# EAGLE design Thermostat (EAGLE 9.1.1)
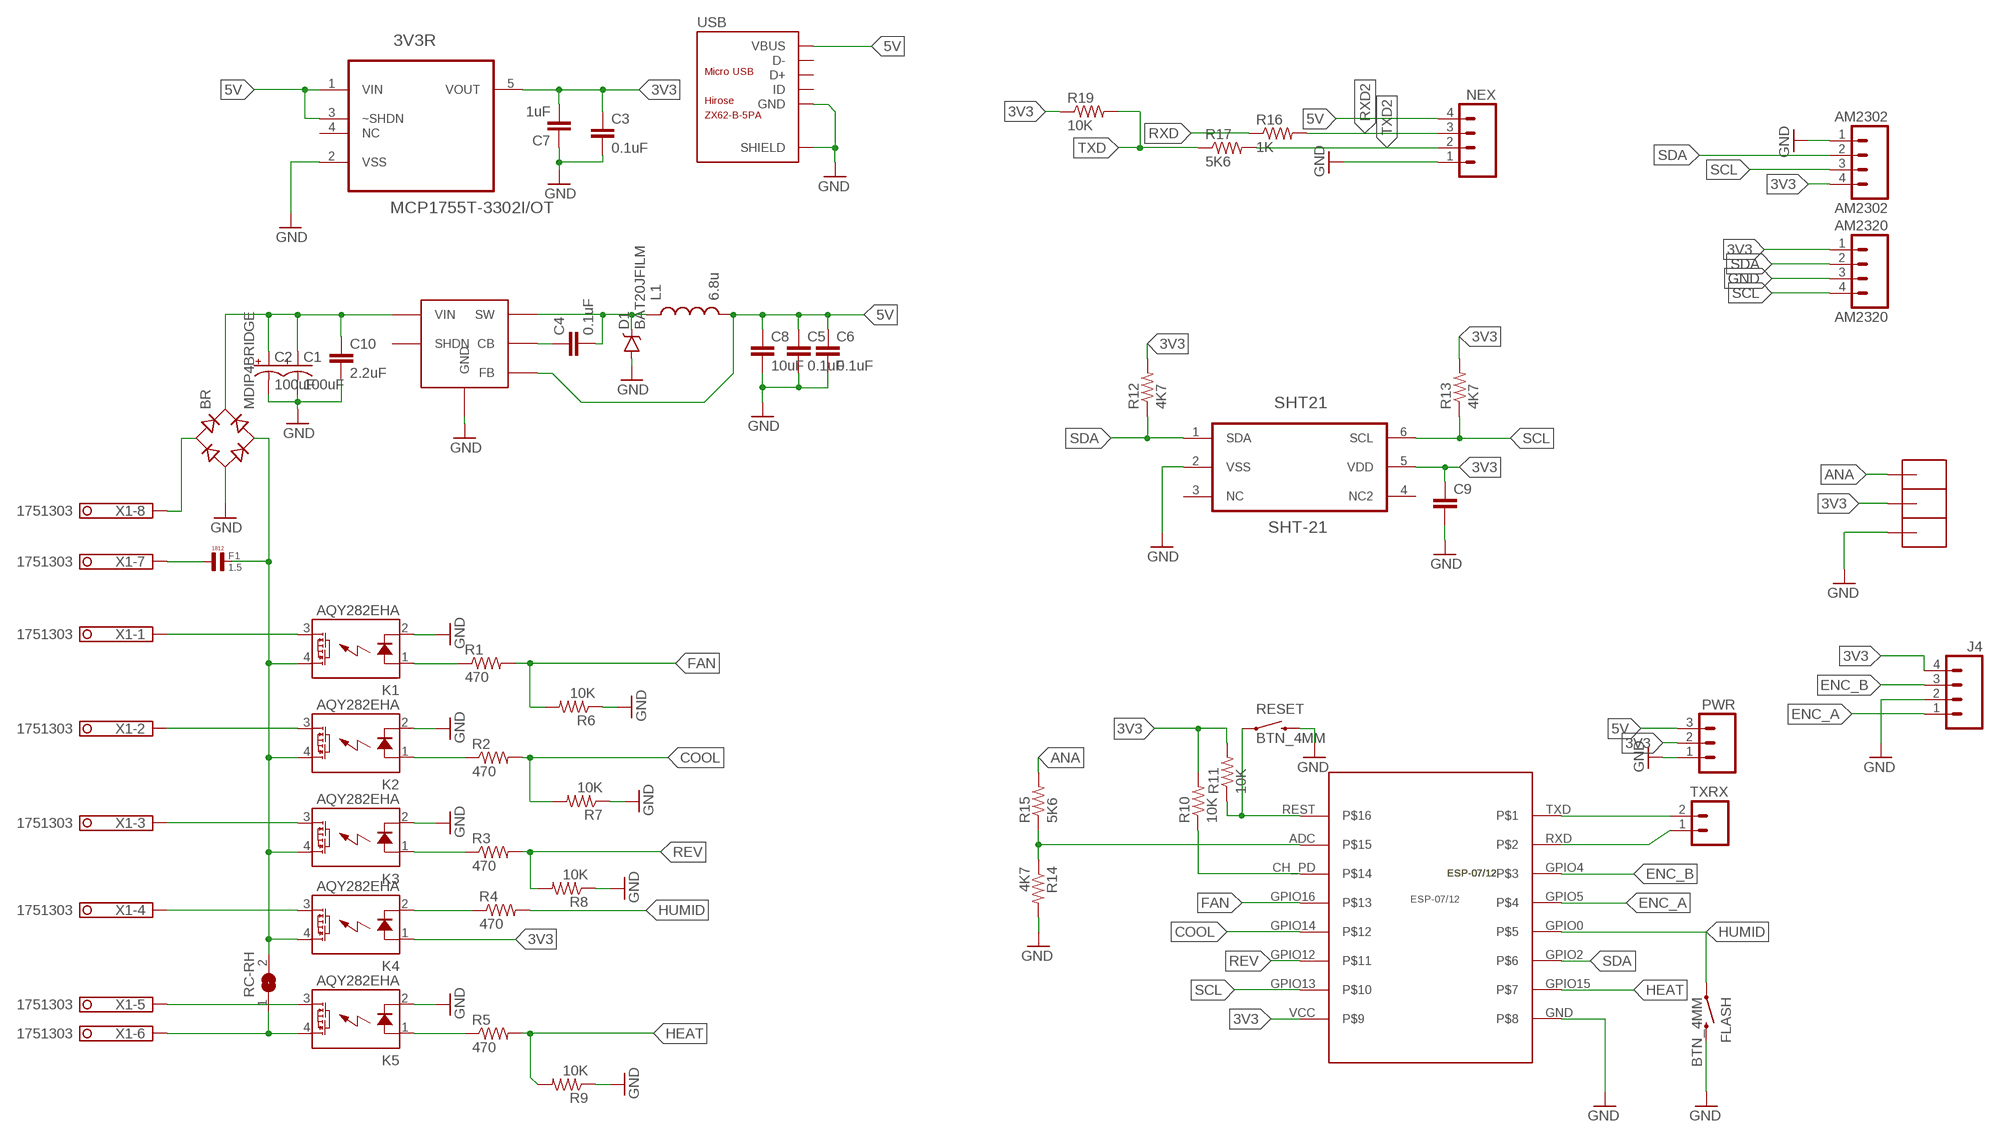
[diagram p0: schematic, sheet 1]

## Parts
3V3R  MCP1755T-3302I/OT  MCP1801T-3302I/OT  [SOT95P270X145-5N]
AM2302  AM2302  M04PTH  [1X04]
AM2320  AM2320  M04PTH  [1X04]
BR  MDIP4BRIDGE  [MICRODIP4]
C1  100uF  CAP_POLC  [PANASONIC_C]
C2  100uF  CAP_POLC  [PANASONIC_C]
C3  0.1uF  CAP0805  [0805]
C4  0.1uF  CAP0805  [0805]
C5  0.1uF  CAP0805  [0805]
C6  0.1uF  CAP0805  [0805]
C7  1uF  CAP0805  [0805]
C8  10uF  CAP0805  [0805]
C9  CAP0603-CAP  [0603-CAP]
C10  2.2uF  CAP0805  [0805]
D1  BAT20JFILM  [SOD-323]
F1  1.5  0,1µF  [L4,8]
FLASH  BTN_4MM  [BTN_4MM]
J4  M04PTH  [1X04]
K1  AQY282EHA  AQY22SOP  [SOP04]
K2  AQY282EHA  AQY22SOP  [SOP04]
K3  AQY282EHA  AQY22SOP  [SOP04]
K4  AQY282EHA  AQY22SOP  [SOP04]
K5  AQY282EHA  AQY22SOP  [SOP04]
L1  6.8u  INDUCTOR1007  [1007]
NEX  M04PTH  [1X04]
PWR  M03PTH  [1X03]
R1  470  RESISTOR0805-RES  [0805]
R2  470  RESISTOR0805-RES  [0805]
R3  470  RESISTOR0805-RES  [0805]
R4  470  RESISTOR0805-RES  [0805]
R5  470  RESISTOR0805-RES  [0805]
R6  10K  RESISTOR0805-RES  [0805]
R7  10K  RESISTOR0805-RES  [0805]
R8  10K  RESISTOR0805-RES  [0805]
R9  10K  RESISTOR0805-RES  [0805]
R10  10K  RESISTOR0805-RES  [0805]
R11  10K  RESISTOR0805-RES  [0805]
R12  4K7  RESISTOR0805-RES  [0805]
R13  4K7  RESISTOR0805-RES  [0805]
R14  4K7  RESISTOR0805-RES  [0805]
R15  5K6  RESISTOR0805-RES  [0805]
R16  1K  RESISTOR0805-RES  [0805]
R17  5K6  RESISTOR0805-RES  [0805]
R19  10K  RESISTOR0805-RES  [0805]
RC-RH  SJ  [SJ]
RESET  BTN_4MM  [BTN_4MM]
SHT21  SHT-21  [SHT21]
TXRX  M02PTH  [1X02]
U$1  ESP-07/12  [ESP-07/12]
U$2  SMD-PAD182X64  [SMD-PAD1]
U$3  SMD-PAD182X64  [SMD-PAD1]
U$4  SMD-PAD182X64  [SMD-PAD1]
USB  ZX62-B-5PA  MICRO-USB-SMD(ZX62-B-5PA)  [MICRO-USB5+6P-SMD-0.65-AB]
VREG  LMR16006YQ  [SOT-23-6]
X1  1751303  [1751303]

## Nets
3V3: 3V3R.5(VOUT) AM2302.4 AM2320.1 C3.1 C7.2 C9.1 J4.4 K4.1(A) PWR.2 R10.2 R11.2 R12.2 R13.2 R19.1 SHT21.5(VDD) U$1.VCC U$3.>PAD
5V: 3V3R.1(VIN) 3V3R.3(~SHDN) C5.1 C6.1 C8.1 L1.2 NEX.4 PWR.3 USB.1(VBUS) VREG.3(FB)
ADC: R14.1 R15.1 U$1.ADC
ANA: R15.2 U$4.>PAD
COOL: R2.2 R7.2 U$1.GPIO14
ENC_A: J4.1 U$1.GPIO5
ENC_B: J4.3 U$1.GPIO4
FAN: R1.2 R6.2 U$1.GPIO16
GND: 3V3R.2(VSS) AM2302.1 AM2320.3 BR.- C1.- C2.- C3.2 C5.2 C6.2 C7.1 C8.2 C9.2 C10.2 D1.A FLASH.2 J4.2 K1.2(K) K2.2(K) K3.2(K) K5.2(K) NEX.1 PWR.1 R6.1 R7.1 R8.1 R9.1 R14.2 RESET.2 SHT21.2(VSS) U$1.GND U$2.>PAD USB.5(GND) USB.P1(SHIELD) USB.P2(SHIELD) USB.P3(SHIELD) USB.P4(SHIELD) USB.P5(SHIELD) USB.P6(SHIELD) VREG.2(GND)
HEAT: R5.2 R9.2 U$1.GPIO15
HUMID: FLASH.1 R4.2 U$1.GPIO0
N$1: K4.2(K) R4.1
N$2: C4.2 D1.C L1.1 VREG.6(SW)
N$3: BR.AC2 F1.P$2 K1.4(DS1) K2.4(DS1) K3.4(DS1) K4.4(DS1) RC-RH.2
N$4: K1.1(A) R1.1
N$7: K2.1(A) R2.1
N$10: K3.1(A) R3.1
N$11: K4.3(DS2) X1.4
N$13: K2.3(DS2) X1.2
N$15: K1.3(DS2) X1.1
N$17: C4.1 VREG.1(CB)
N$18: K5.3(DS2) X1.5
N$20: BR.AC1 X1.8
N$22: K5.4(DS1) RC-RH.1 X1.6
N$23: F1.P$1 X1.7
N$24: BR.+ C1.+ C2.+ C10.1 VREG.5(VIN)
N$25: K5.1(A) R5.1
N$29: K3.3(DS2) X1.3
N$30: R10.1 U$1.CH_PD
REST: R11.1 RESET.1 U$1.REST
REV: R3.2 R8.2 U$1.GPIO12
RXD: R16.1 TXRX.1 U$1.RXD
RXD2: NEX.3 R16.2
SCL: AM2302.3 AM2320.4 R13.1 SHT21.6(SCL) U$1.GPIO13
SDA: AM2302.2 AM2320.2 R12.1 SHT21.1(SDA) U$1.GPIO2
TXD: R17.1 R19.2 TXRX.2 U$1.TXD
TXD2: NEX.2 R17.2
Unconnected: 3V3R.4(NC) SHT21.4(NC2) USB.2(D-) USB.3(D+) USB.4(ID) VREG.4(SHDN)

## Power pins joined to a net without a drawn wire
NC: SHT21.3(NC)

## Library data of the parts
3V3R = Microchip_By_element14_Batch_1:MCP1801T-3302I/OT: Low Quiescent Current LDO; MPN: MCP1801T-3302I/OT; OC_FARNELL: 1578370; OC_NEWARK: 54M4830; PACKAGE: SOT-5; SUPPLIER: Microchip
AM2302 AM2320 J4 NEX = SparkFun-Connectors:M04: Header 4 Standard 4-pin 0.1" header. Use with straight break away headers (SKU : PRT-00116), right angle break away headers (PRT-00553), swiss pins (PRT-00743), machine pins (PRT-00117), and female headers (PRT-00115). Molex polarized connector foot print use with SKU : PRT-08231 with associated crimp pins and housings. 1MM SMD Version SKU: PRT-10208; PROD_ID: CONN-09696
BR = CuriousTech:MDIP4BRIDGE
C1 C2 = SparkFun-Capacitors:CAP_POL: Capacitor Polarized These are standard SMD and PTH capacitors. Normally 10uF, 47uF, and 100uF in electrolytic and tantalum varieties. Always verify the external diameter of the through hole cap, it varies with capacity, voltage, and manufacturer. The EIA devices should be standard.
C3-C10 = SparkFun-Capacitors:CAP: Capacitor Standard 0603 ceramic capacitor, and 0.1" leaded capacitor.
D1 = SparkFun-DiscreteSemi:BAT20JFILM: 23V, 1A Schottky diode, SOD-323 package; PROD_ID: DIO-11623
F1 = Capacitor-Wima-SMD1812-100v:0,1µF
FLASH RESET = CuriousTech:BTN_4MM
K1-K5 = relay:AQY*: PhotoMOS Relay NAiS Source: http://www.panasonic-electric-works.com/catalogues/downloads/photomos/ds_x615_en_aqz10_20.pdf; OC_FARNELL: unknown; OC_NEWARK: unknown
L1 = SparkFun-Passives:INDUCTOR: Inductors Basic Inductor/Choke - 0603 and 1206. Footprints are not proven and vary greatly between part numbers. INDUCTOR POWER 3.3UH 4.0A SMD 0.197" L x 0.197" W x 0.177" H (5.00mm x 5.00mm x 4.50mm)
PWR = SparkFun-Connectors:M03: Header 3 Standard 3-pin 0.1" header. Use with straight break away headers (SKU : PRT-00116), right angle break away headers (PRT-00553), swiss pins (PRT-00743), machine pins (PRT-00117), and female headers (PRT-00115). Molex polarized connector foot print use with SKU : PRT-08232 with associated crimp pins and housings.
R1-R9 = SparkFun-Passives:RESISTOR: Resistor Basic schematic elements and footprints for 0603, 1206, and PTH resistors.
R10-R17 R19 = SparkFun-Resistors:RESISTOR: Resistor Basic schematic elements and footprints for 0603, 1206, and PTH resistors.
RC-RH = jumper:SJ: SMD solder JUMPER
SHT21 = CuriousTech:SHT-21
TXRX = SparkFun-Connectors:M02: Standard 2-pin 0.1" header. Use with - straight break away headers ( PRT-00116) - right angle break away headers (PRT-00553) - swiss pins (PRT-00743) - machine pins (PRT-00117) - female headers (PRT-00115) Molex polarized connector foot print use with: PRT-08233 with associated crimp pins and housings. 2.54_SCREWTERM for use with PRT-10571. 3.5mm Screw Terminal footprints for PRT-08084 5mm Screw Terminal footprints for use with PRT-08432
U$1 = ESP-07_12:ESP-07/12: Version 1.0 of the library for the ESP-07/12 full GPIO dev board module byME Jon jonnyradu@gmail.com
U$2-U$4 = CuriousTech:SMD-PAD1: SMD-PAD small
USB = Seeed-OPL-Connector:MICRO-USB-SMD(ZX62-B-5PA): 320010005; MPN: ZX62-B-5PA
VREG = CuriousTech:LMR16006YQ
X1 = con-phoenix-350:1751303: MKDS 1/ 8-3,5 Printklemme Nennstrom: 10 A Bemessungsspannung: 160 V Raster: 3,5 mm Polzahl: 8 Montageart: Löten Anschlussart: Schraubanschluss Anschlussrichtung vom Leiter zur Platine: 0° Source: http://eshop.phoenixcontact.com .. .pdf; OC_FARNELL: unknown; OC_NEWARK: unknown

## Board
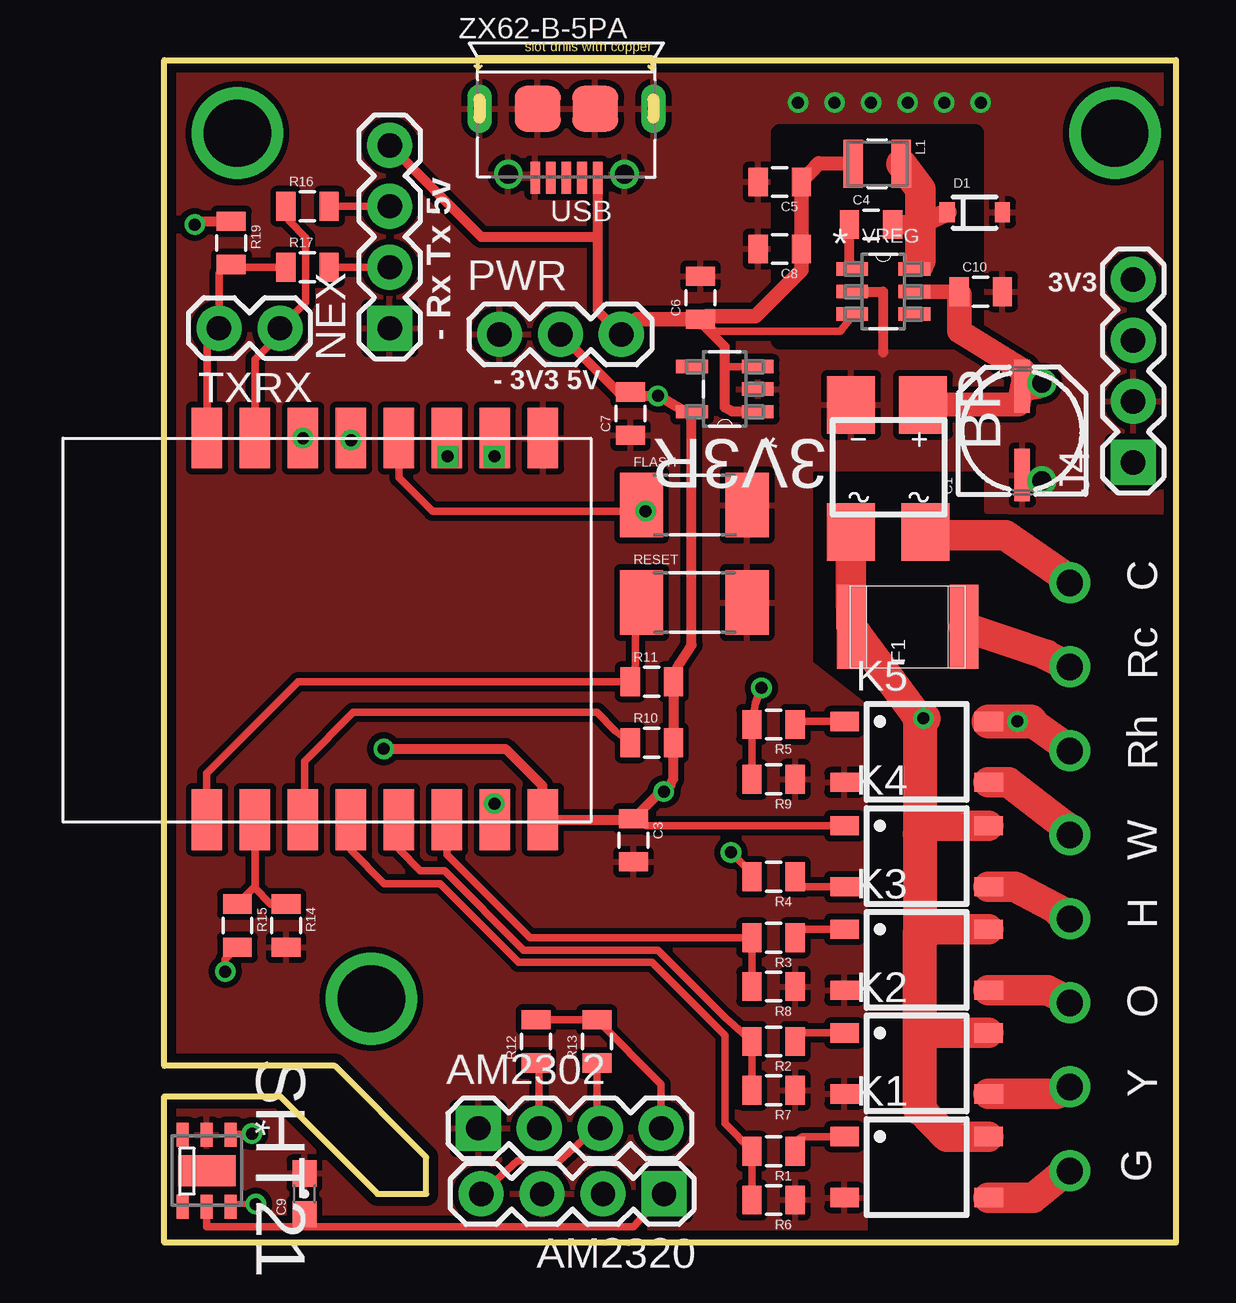
[diagram p1: board, top side]
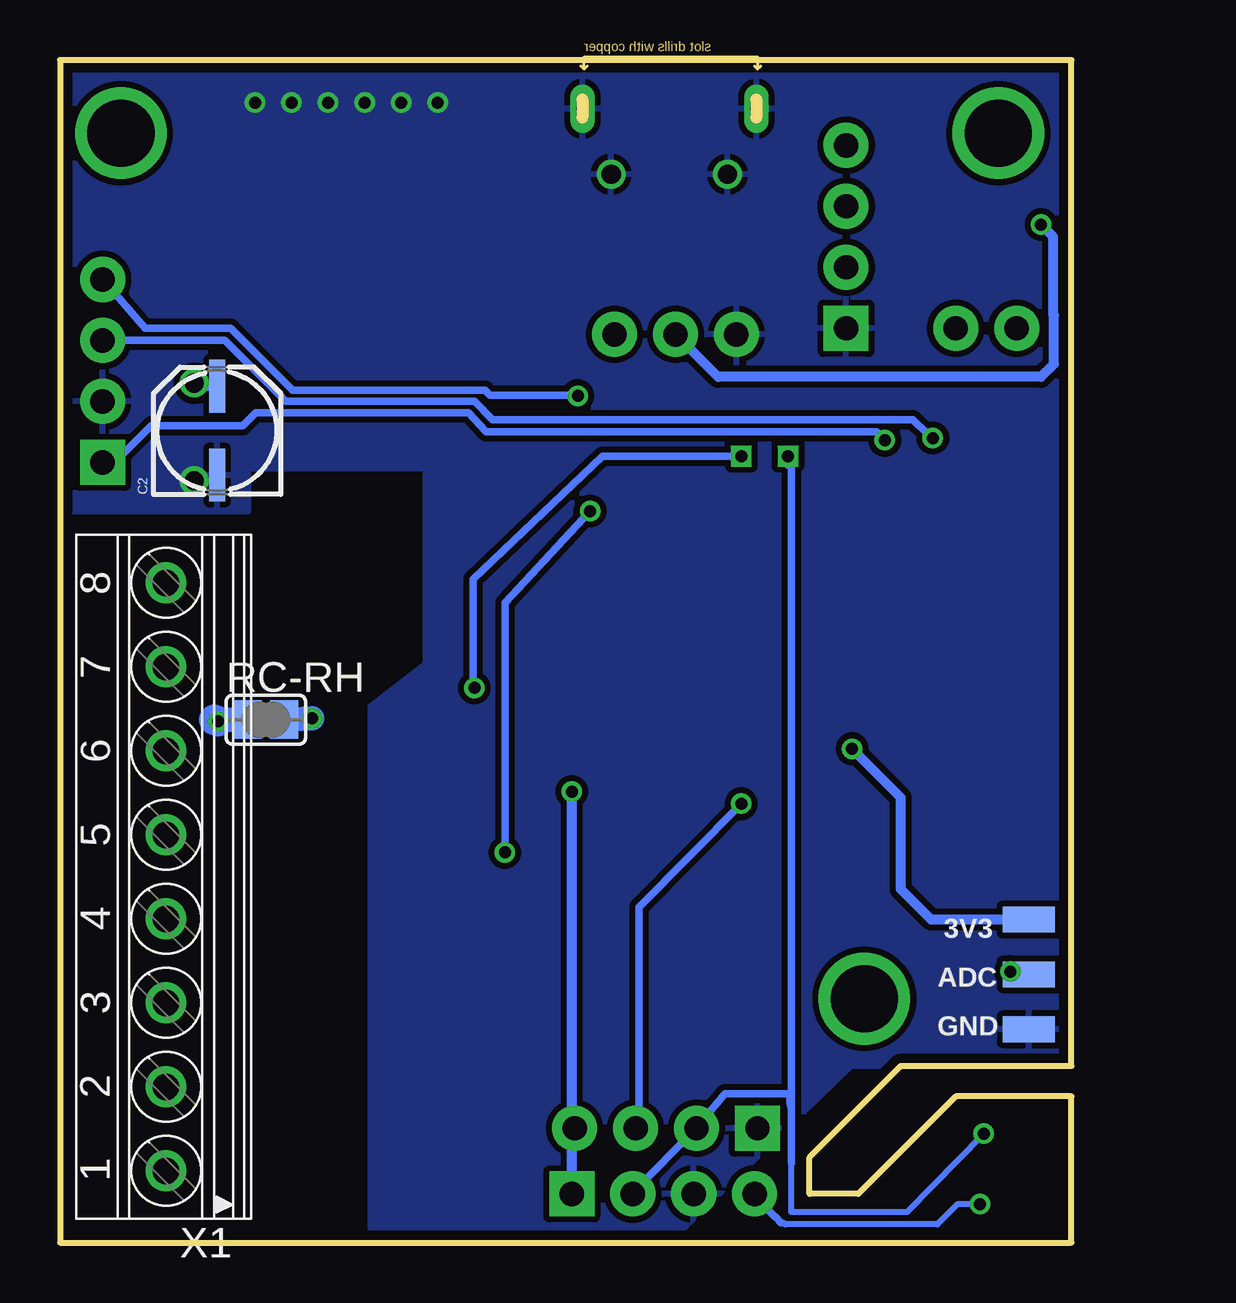
[diagram p2: board, bottom side, seen from below]

Size 42.16 x 49.28 mm. Coordinates in mm from the lower left corner, seen from the top.
Outline: 42.16,0 0,0 0,6.1 4.83,6.1 8.89,2.03 10.92,2.03 10.92,3.56 7.11,7.37 0,7.37 0,49.28 42.16,49.28 42.16,0
Copper layers (1*16): Top 0.0356mm / dielectric 1.5011mm / Bottom 0.0356mm
Design rules "LaenPCBOrder": minimum track width 6mil, minimum drill 13mil, track to track 6mil, track to pad 6mil, pad to pad 6mil, via to via 6mil, smd to smd 6mil, copper to edge 15mil, drill to drill 6mil, minimum pad ring 7mil, minimum via ring 7mil, stop-mask expansion 4mil, vias tented up to drill 0mil, thermal gap 10mil
tRestrict: area 25.7,37.6 to 33.8,46.2

### Footprints (pad centres in the part's own frame; a part is rotated, then mirrored left to right if it is on the bottom)
SOT95P270X145-5N = smd 1.321 x 0.559: 1 -1.372,0.94; 2 -1.372,0; 3 -1.372,-0.94; 4 1.372,-0.94; 5 1.372,0.94
1X04 = drill 1.016 pad 1.88 square: 1 0,0 | drill 1.016 pad 1.88: 2 2.54,0; 3 5.08,0; 4 7.62,0
MICRODIP4 = smd 2 x 2.4: + -1.4,-2.65; - 1.6,-2.65; AC1 -1.5,2.65; AC2 1.6,2.65
PANASONIC_C = smd 2.2 x 0.65: + 1.9,-0.2; - -1.8,-0.2
0805 = smd 0.8 x 1.2: 1 -0.9,0; 2 0.9,0
0603-CAP = smd 1.1 x 1: 1 -0.85,0; 2 0.85,0
SOD-323 = smd 0.63 x 0.83: A 1.15,0; C -1.15,0
L4,8 = smd 3.5 x 1.2: P$1 0,-2.35; P$2 0,2.35
BTN_4MM = smd 1.8 x 2.7: 1 -2.2,0; 2 2.2,0
SOP04 = smd 0.8 x 1.2: 1 -1.27,-3; 2 1.27,-3; 3 1.27,3; 4 -1.27,3
1007 = smd 2 x 0.8: 1 0,1; 2 0,-1
1X03 = drill 1.016 pad 1.88: 1 0,0; 2 2.54,0; 3 5.08,0
SJ = smd 1.168 x 1.6: 1 -0.762,0; 2 0.762,0
SHT21 = smd 1 x 0.5: 1 -1.5,1; 2 -1.5,0; 3 -1.5,-1; 4 1.5,-1; 5 1.5,0; 6 1.5,1 | smd 1.3 x 2.4: P$1 0,0
1X02 = drill 1.016 pad 1.88: 1 0,0; 2 2.54,0
ESP-07/12 = smd 2.54 x 1.27: ADC 0.1,14; CH_PD 0.1,12; GND 16,2; GPIO0 16,8; GPIO2 16,6; GPIO4 16,12; GPIO5 16,10; GPIO12 0.1,6; GPIO13 0.1,4; GPIO14 0.1,8; GPIO15 16,4; GPIO16 0.1,10; REST 0.1,16; RXD 16,14; TXD 16,16; VCC 0.1,2
SMD-PAD1 = smd 2.184 x 1.067: >PAD 0,0
MICRO-USB5+6P-SMD-0.65-AB = smd 0.4 x 1.35: 1 -1.3,2.875; 2 -0.65,2.875; 3 0,2.875; 4 0.65,2.875; 5 1.3,2.875 | smd 1.9 x 1.9: P1 -1.2,0; P2 1.2,0 | drill 0.508 pad 1.016 long: P3 -3.625,0; P4 3.625,0 | drill 0.8: P5 -2.425,2.73; P6 2.425,2.73
SOT-23-6 = smd 1.321 x 0.559: 1 -1.295,0.94; 2 -1.295,0; 3 -1.295,-0.94; 4 1.295,-0.94; 5 1.295,0; 6 1.295,0.94
1751303 = drill 1.1 pad 1.7: 1 -12.25,-0.1; 2 -8.75,-0.1; 3 -5.25,-0.1; 4 -1.75,-0.1; 5 1.75,-0.1; 6 5.25,-0.1; 7 8.75,-0.1; 8 12.25,-0.1

### Placement (x,y rotation side)
3V3R  23.37,35.56 180 top
AM2302  13.09,4.76 0 top
AM2320  20.83,2.03 180 top
BR  30.23,32.26 180 top
C1  35.56,33.78 90 top
C2  35.81,33.78 90 bottom
C3  19.56,16.76 270 top
C4  29.46,42.42 0 top
C5  25.65,44.2 180 top
C6  22.35,39.37 90 top
C7  19.43,34.54 90 top
C8  25.65,41.4 180 top
C9  5.84,2.03 90 top
C10  34.04,39.62 0 top
D1  33.78,42.93 0 top
F1  30.99,25.65 90 top
FLASH  22.1,30.73 0 top
J4  40.39,32.51 90 top
K1  31.36,3.15 270 top
K2  31.36,7.47 270 top
K3  31.36,11.78 270 top
K4  31.36,16.1 270 top
K5  31.36,20.45 270 top
L1  29.72,44.96 270 top
NEX  9.4,38.1 90 top
PWR  13.97,37.85 0 top
R1  25.4,3.81 180 top
R2  25.4,8.38 180 top
R3  25.4,12.7 180 top
R4  25.4,15.24 180 top
R5  25.4,21.59 180 top
R6  25.4,1.78 180 top
R7  25.4,6.35 180 top
R8  25.4,10.67 180 top
R9  25.4,19.3 180 top
R10  20.32,20.83 0 top
R11  20.32,23.37 0 top
R12  15.49,8.38 90 top
R13  18.03,8.38 90 top
R14  5.08,13.21 270 top
R15  3.05,13.21 270 top
R16  5.97,43.18 0 top
R17  5.97,40.64 0 top
R19  2.79,41.66 270 top
RC-RH  33.58,21.79 0 bottom
RESET  22.1,26.67 0 top
SHT21  1.78,3 270 top
TXRX  4.83,38.1 180 top
U$1  17.78,17.53 90 top
U$2  1.78,8.89 0 bottom
U$3  1.78,13.46 0 bottom
U$4  1.78,11.18 0 bottom
USB  16.76,47.24 180 top
VREG  29.97,39.62 0 top
X1  37.85,15.24 90 bottom

### Tracks (layer width: path | path; a pad name or v marks a point on that pad's centre or on a via)
3V3  (via drill 0.5)
  Top 0.305: SHT21.5 1.78,0.66 5.59,0.66 | 5.59,0.66 19.56,0.66 AM2320.1 | C9.1 5.59,1.18 5.59,0.66 | 21.47,24.13 21.34,23.99 21.34,23.74 | R12.2 R13.2 20.71,6.6 AM2302.4 | C3.1 20.1,17.37 K4.1 | 19.97,35.28 19.72,35.28 C7.2 19.58,35.42 19.7,35.42
  Top 0.406: v9.14,20.57 14.22,20.57 15.75,19.05 15.75,17.66 U$1.VCC 19.27,17.63 C3.1 20.57,18.68 v20.83,18.8 21.1,19.07 21.22,19.33 R10.2 R11.2 21.34,23.74 | 21.47,24.13 21.98,24.89 21.98,34.54 21.91,34.62 | 19.97,35.28 v20.57,35.28 21.59,34.68 21.91,34.62 | 3V3R.5 21.91,34.62 | 19.7,35.42 18.93,35.42 PWR.2 | v1.27,42.42 1.41,42.56 R19.1
  Bottom 0.305: 20.85,35.31 24.25,35.31 24.45,35.51 32.46,35.51 35.05,38.1 38.61,38.1 J4.4 | AM2302.4 20.71,4.83 20.83,4.83
  Bottom 0.406: v9.14,20.57 7.11,18.54 7.11,14.73 5.84,13.46 U$3.>PAD | AM2320.1 20.83,4.83 v20.83,18.8 | 20.83,35.31 20.85,35.31 v20.57,35.28 | v1.27,42.42 0.76,41.91 0.76,38.66 0.74,38.64 0.74,36.6 1.27,36.07 14.73,36.07 PWR.2
5V
  Top 0.305: VREG.3 28.63,38.53 28.19,37.97 22.99,37.97 22.35,38.35 | 3V3R.3 23.44,36.5 23.37,36.58
  Top 0.406: C6.1 22.35,38.35 23.37,37.34 23.37,36.58 23.37,34.8 23.7,34.62 3V3R.1 | USB.1 18.06,41.91 | 18.06,41.91 18.06,38.83 PWR.3 | NEX.4 13.21,41.91 18.06,41.91
  Top 0.61: L1.2 27.28,44.97 C5.1 C8.1 26.55,40.52 24.64,38.61 22.61,38.61 22.35,38.35 | C6.1 19.67,38.47 PWR.3
ADC
  Top 0.305: U$1.ADC 3.81,17.63 | 3.76,18.29 3.78,18.26 U$1.ADC | U$1.ADC 3.78,14.84 3.74,14.8 | 3.74,14.8 R15.1 | 3.74,14.8 4.43,14.11 R14.1
ANA  (via drill 0.5)
  Top 0.305: R15.2 2.54,11.8 v2.54,11.29
  Bottom 0.305: v2.54,11.29 1.89,11.29 U$4.>PAD
COOL
  Top 0.305: U$1.GPIO14 9.78,16.38 10.67,15.49 11.68,15.49 14.99,12.19 20.57,12.19 23.37,9.4 R2.2 R7.2
ENC_A  (via drill 0.5)
  Top 0.406: U$1.GPIO5 v7.78,33.43
  Bottom 0.305: v7.78,33.43 8.13,33.78 24.4,33.78 25.14,34.57 34.01,34.57 34.54,34.04 38.35,34.04 39.88,32.51 J4.1
ENC_B  (via drill 0.5)
  Top 0.305: U$1.GPIO4 5.78,33.47 5.84,33.53
  Bottom 0.305: U$1.GPIO4 6.03,33.72 6.6,34.29 24.13,34.29 24.89,35.05 32.77,35.05 35.31,37.59 J4.3
  other vias: 5.78,33.53
FAN
  Top 0.305: U$1.GPIO16 7.78,16.35 9.17,14.96 11.5,14.96 14.78,11.68 20.32,11.68 23.37,8.64 23.37,4.96 24.52,3.81 R1.2 R6.2
GND  (via drill 0.5, 0.8)
  Top 0.406: VREG.2 29.97,39.62 29.97,37.08
  other vias: 26.42,47.5 27.94,47.5 29.46,47.5 30.99,47.5 32.51,47.5 34.04,47.5 36.58,31.75
  pour Top (isolate 0.254): 0,1.27 15.24,1.27 16.51,0 29.21,0 29.21,22.35 26.92,24.13 26.92,32.26 34.29,32.26 34.29,30.48 42.16,30.48 42.16,49.28 0,49.28
  pour Bottom (isolate 0.254): 42.16,30.48 34.29,30.48 34.29,32.26 26.92,32.26 26.92,24.13 29.21,22.35 29.21,0.25 28.96,0 16.76,0 9.14,7.37 0,7.37 0,49.28 42.16,49.28
HEAT  (via drill 0.5)
  Top 0.305: 13.78,32.96 v13.77,32.77 | U$1.GPIO15 13.78,32.83 | 13.78,32.83 v13.77,32.77 | 13.78,32.83 v13.78,32.78 v13.77,32.77 | v24.89,23.11 24.64,22.47 R5.2 R9.2
  Bottom 0.305: v13.77,32.77 19.56,32.77 24.94,27.64 24.94,23.29 24.64,23.09 v24.89,23.11
HUMID  (via drill 0.5)
  Top 0.305: U$1.GPIO0 9.78,31.88 11.18,30.48 v20.07,30.48 19.81,30.48 FLASH.1 | R4.2 24.38,15.51 v23.62,16.26
  Bottom 0.305: v23.62,16.26 23.62,26.67 v20.07,30.48
N$1
  Top 0.305: K4.2 26.45,14.83 R4.1
N$2
  Top 0.61: 31.5,40.89 31.75,40.59 VREG.6
  Top 0.813: D1.C 31.52,42.42 C4.2
  Top 1.016: 31.52,40.92 31.5,40.89
  Top 1.27: L1.1 31.52,43.9 31.52,42.42 31.52,40.92
N$3  (via drill 0.5)
  Top 1.27: K3.4 32.1,13.05 | 32.1,13.05 31.5,12.7 | K1.4 32.61,4.42 31.5,5.59 | K2.4 31.6,8.74 31.5,8.38 | 31.5,12.9 32.1,13.05 | K4.4 31.85,17.37 31.5,17.02 | 31.5,21.78 F1.P$2 28.63,27.17 BR.AC2
  Top 1.422: 31.5,5.59 31.5,8.38 31.5,12.7 31.5,12.9 31.5,17.02 31.5,21.78 31.5,21.84 v31.65,21.84
  Bottom 1.016: v31.65,21.84 RC-RH.2
N$4
  Top 0.305: 28.26,4.32 K1.1 26.65,4.42 arc90 R1.1
N$5  (via drill 2.8)
  other vias: 8.64,10.16
N$6  (via drill 2.8)
  other vias: 39.62,46.23
N$7
  Top 0.305: K2.1 26.4,8.74 R2.1
N$8  (via drill 2.8)
  other vias: 3.05,46.23
N$10
  Top 0.305: K3.1 26.45,13.05 R3.1
N$11
  Top 1.27: K4.3 35.46,14.83 37.08,13.97 | 37.08,13.97 37.56,13.72 | X1.4 37.56,13.49 37.08,13.97
N$13
  Top 1.27: X1.2 37.2,6.2 K2.3
N$15
  Top 1.27: K1.3 36.23,1.88 37.59,2.99 X1.1
N$17
  Top 0.406: VREG.1 28.56,40.68 C4.1
N$18
  Top 1.27: K5.3 35.18,19.18 37.37,17.5 37.75,17.24 X1.5
N$20
  Top 1.27: BR.AC1 32.09,29.46 35.05,29.46 37.49,27.79 X1.8
N$22  (via drill 0.5)
  Top 1.27: 36.1,21.72 37.53,20.7 X1.6
  Top 1.422: K5.4 v35.56,21.72 36.01,21.72 36.1,21.72 36.11,21.72
  Bottom 1.016: RC-RH.1 35.74,21.79
  Bottom 1.27: 35.74,21.79 v35.56,21.72
N$23
  Top 1.27: F1.P$1 36.78,24.5 36.73,24.5 X1.7
N$24  (via drill 0.8)
  Top 0.305: 33.27,39.23 32.86,39.23 33.14,37.98
  Top 0.406: v36.58,35.81 35.81,35.56
  Top 0.61: C10.1 33.27,39.23 | VREG.5 C10.1 | 33.27,39.62 C10.1
  Top 1.016: BR.+ 35.61,34.92 C1.+ 36.45,35.69 35.81,35.56 35.81,36.32 33.14,37.98 33.15,39.51
  Bottom 0.406: C2.+ 36.7,35.68 v36.58,35.81
N$25
  Top 0.305: K5.1 26.43,21.72 R5.1
N$29
  Top 1.27: K3.3 36.81,10.51 37.85,9.99 X1.3
N$30
  Top 0.305: U$1.CH_PD 5.84,17.88 5.84,20.07 7.87,22.1 18.03,22.1 18.8,21.34 R10.1
REST
  Top 0.305: 19.61,23.82 19.05,23.37 5.59,23.37 1.78,19.56 1.78,17.88 U$1.REST 1.78,17.17 | 19.61,23.82 R11.1 | RESET.1 19.81,26.16 19.64,25.99 19.64,24.11 19.61,23.82
REV
  Top 0.305: U$1.GPIO12 11.78,16.16 15.24,12.7 R3.2 R8.2
RXD
  Top 0.305: U$1.RXD 3.78,36.8 4.83,37.85 TXRX.1 5.9,39.17 5.9,41.87 5.2,42.58 R16.1
RXD2
  Top 0.305: R16.2 NEX.3
SCL  (via drill 0.5)
  Top 0.254: 2.82,1.8 2.83,1.8 | v3.81,1.6 2.88,1.6 SHT21.6
  Top 0.305: 2.83,1.8 SHT21.6 | U$1.GPIO13 13.78,18.1 13.72,18.03 v13.77,18.29 | AM2320.4 14.73,3.42 16.47,3.42 17.99,4.76 18.03,4.76 | 18.03,4.76 AM2302.3 | R13.1 18.03,4.76
  Bottom 0.254: v3.81,1.6 4.75,1.6 5.59,0.76 11.94,0.76 12.01,0.84 12.12,0.84
  Bottom 0.305: v13.77,18.29 18.03,13.97 18.03,4.9 arc90 AM2302.3 | AM2320.4 13.21,1.93 12.35,1.06 12.35,1.07 12.12,0.84
SDA  (via drill 0.5)
  Top 0.254: v3.66,4.55 2.83,4.55
  Top 0.305: U$1.GPIO2 11.78,32.67 v11.81,32.77 | 2.83,4.55 SHT21.1 | R12.1 15.63,7.48 AM2302.2
  Bottom 0.254: v3.66,4.55 6.86,1.27 11.68,1.27 11.68,3.3
  Bottom 0.305: v11.81,32.77 11.81,32.38 11.68,32.51 11.68,5.59 | 11.68,5.59 11.68,3.3 | AM2320.2 18.29,2.11 AM2302.2 15.45,5.02 14.44,6.21 11.75,6.21 11.75,5.84 11.68,5.59
TXD
  Top 0.305: R19.2 2.4,40.64 2.54,40.64 | 2.54,40.64 R17.1 | U$1.TXD 1.78,37.59 TXRX.2 2.29,40.39 2.54,40.64
TXD2
  Top 0.305: R17.2 NEX.2

### Text on the board
tPlace: 3V3 | - Rx Tx 5v | - 3V3 5V | C | Rc | Rh | W | H | O | Y | G
bPlace: 3V3 | ADC | GND
tStop: ESP-07
bStop: ESP8266-HVAC | CuriousTech.net